# Altium schematic sheet ACS712.SchDoc
size A
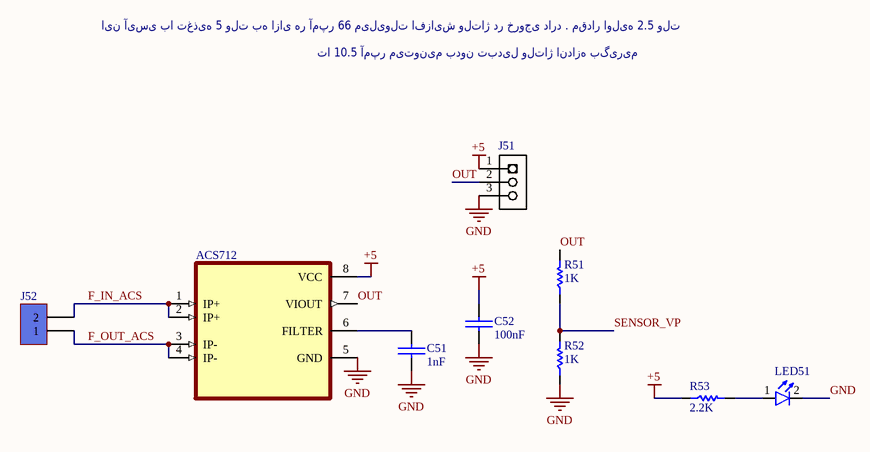
[diagram p0: ACS712.SchDoc]

## Parts
ACS712  ACS712ELCTR30AT  [SOIC127P600X175-8N]  (value not drawn)
C51  1nF  [SMD_CAP_0805]
C52  100nF  [SMD_CAP_0805]
J51  HEADER-1X3  [HEADER-1X3]  (value not drawn)
J52  J1  [KF301 2PIN]  (value not drawn)
LED51  Red  [LED_SMD_0805]  (value not drawn)
R51  1K  [SMD_RES_0805]
R52  1K  [SMD_RES_0805]
R53  2.2K  [SMD_RES_0805]

## Nets
+5: ACS712.8(VCC) C52.1(+) J51.1 R53.1
GND: ACS712.5(GND) C51.2(-) C52.2(-) J51.3 LED51.2(K) R52.1
F_IN_ACS: ACS712.1(IP+) ACS712.2(IP+) J52.2
F_OUT_ACS: ACS712.3(IP-) ACS712.4(IP-) J52.1
OUT: ACS712.7(VIOUT) J51.2 R51.2
SENSOR_VP: R51.1 R52.2
NetACS712_6: ACS712.6(FILTER) C51.1(+)
NetLED51_1: LED51.1(A) R53.2

## Notes on the sheet
- این آیسی با تغذیه 5 ولت به ازای هر آمپر 66 میلیولت افزایش ولتاژ در خروجی دارد . مقدار اولیه 2.5 ولت
- تا 10.5 آمپر میتونیم بدون تبدیل ولتاژ اندازه بگیریم

## Library data of the parts
ACS712 = ACS712ELCTR30AT: Current Sensor 30A 1 Channel Hall Effect, Open Loop Bidirectional 8-SOIC _0.154, 3.90mm Width_; MF: Allegro MicroSystems LLC; SnapEDA_Link: https://www.snapeda.com/parts/ACS712ELCTR30AT/Allegro%20MicroSystems%20LLC/view-part/1228165/?ref=snap; Value: *; Price: None; Availability: Unavailable; MP: ACS712ELCTR30AT; Package: SOIC-8 Allegro MicroSystems LLC
C51 C52 = Cap-Bipolar: Bipolar Capacitor; Voltage: 100V; Designer: Saeid Jorablo; Organazation: ControTec; Adding Date: 1387/12/20
  C51: Value: 1nF
  C52: Value: 100nF
J52 = Terminal_2pin
LED51 = LED: Designer: Saeid Jorablo; Organazation: ControTec; Adding Date: 1387/12/22; Color: Red; Size: SMD 1206
R51-R53 = Resistor: Tolerance: 5%; Power: 1/8 W
  R51 R52: Value: 1K
  R53: Value: 2.2K
J51 = HEADER-1X3: Supplier 1: Digi-Key; Supplier Part Number 1: S1011E-36-ND